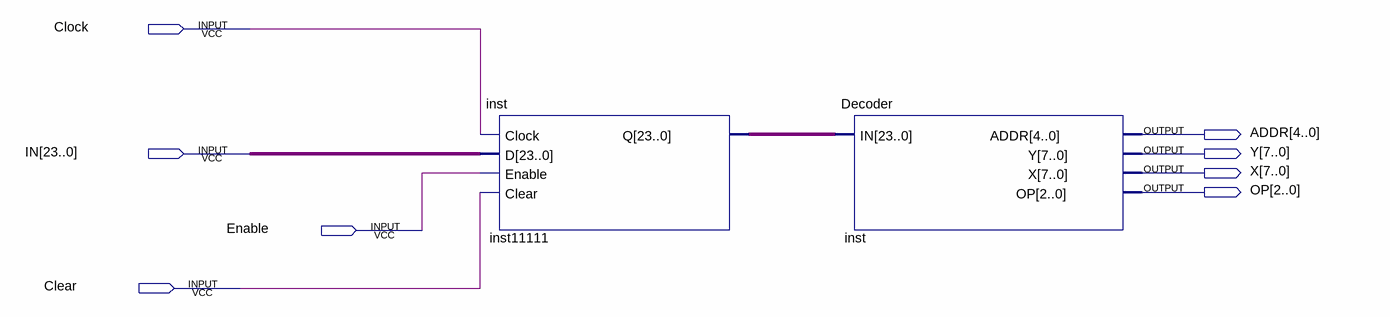
[diagram p0: schematic sheet]
// Quartus schematic Decode.bdf as structural Verilog: 2 symbols, 8 pins
module Decode (
  input  Clock,
  input  [23:0] IN,
  input  Enable,
  input  Clear,
  output [4:0] ADDR,
  output [7:0] Y,
  output [7:0] X,
  output [2:0] OP
);

  wire [23:0] inst11111_q;

  inst inst11111 (.Clock(Clock), .D(IN), .Enable(Enable), .Clear(Clear), .Q(inst11111_q));
  Decoder inst (.IN(inst11111_q), .ADDR(ADDR), .Y(Y), .X(X), .OP(OP));
endmodule
